# Altium schematic sheet DI_DO.SchDoc
size A2; SheetNumber: 4; SheetTotal: 4
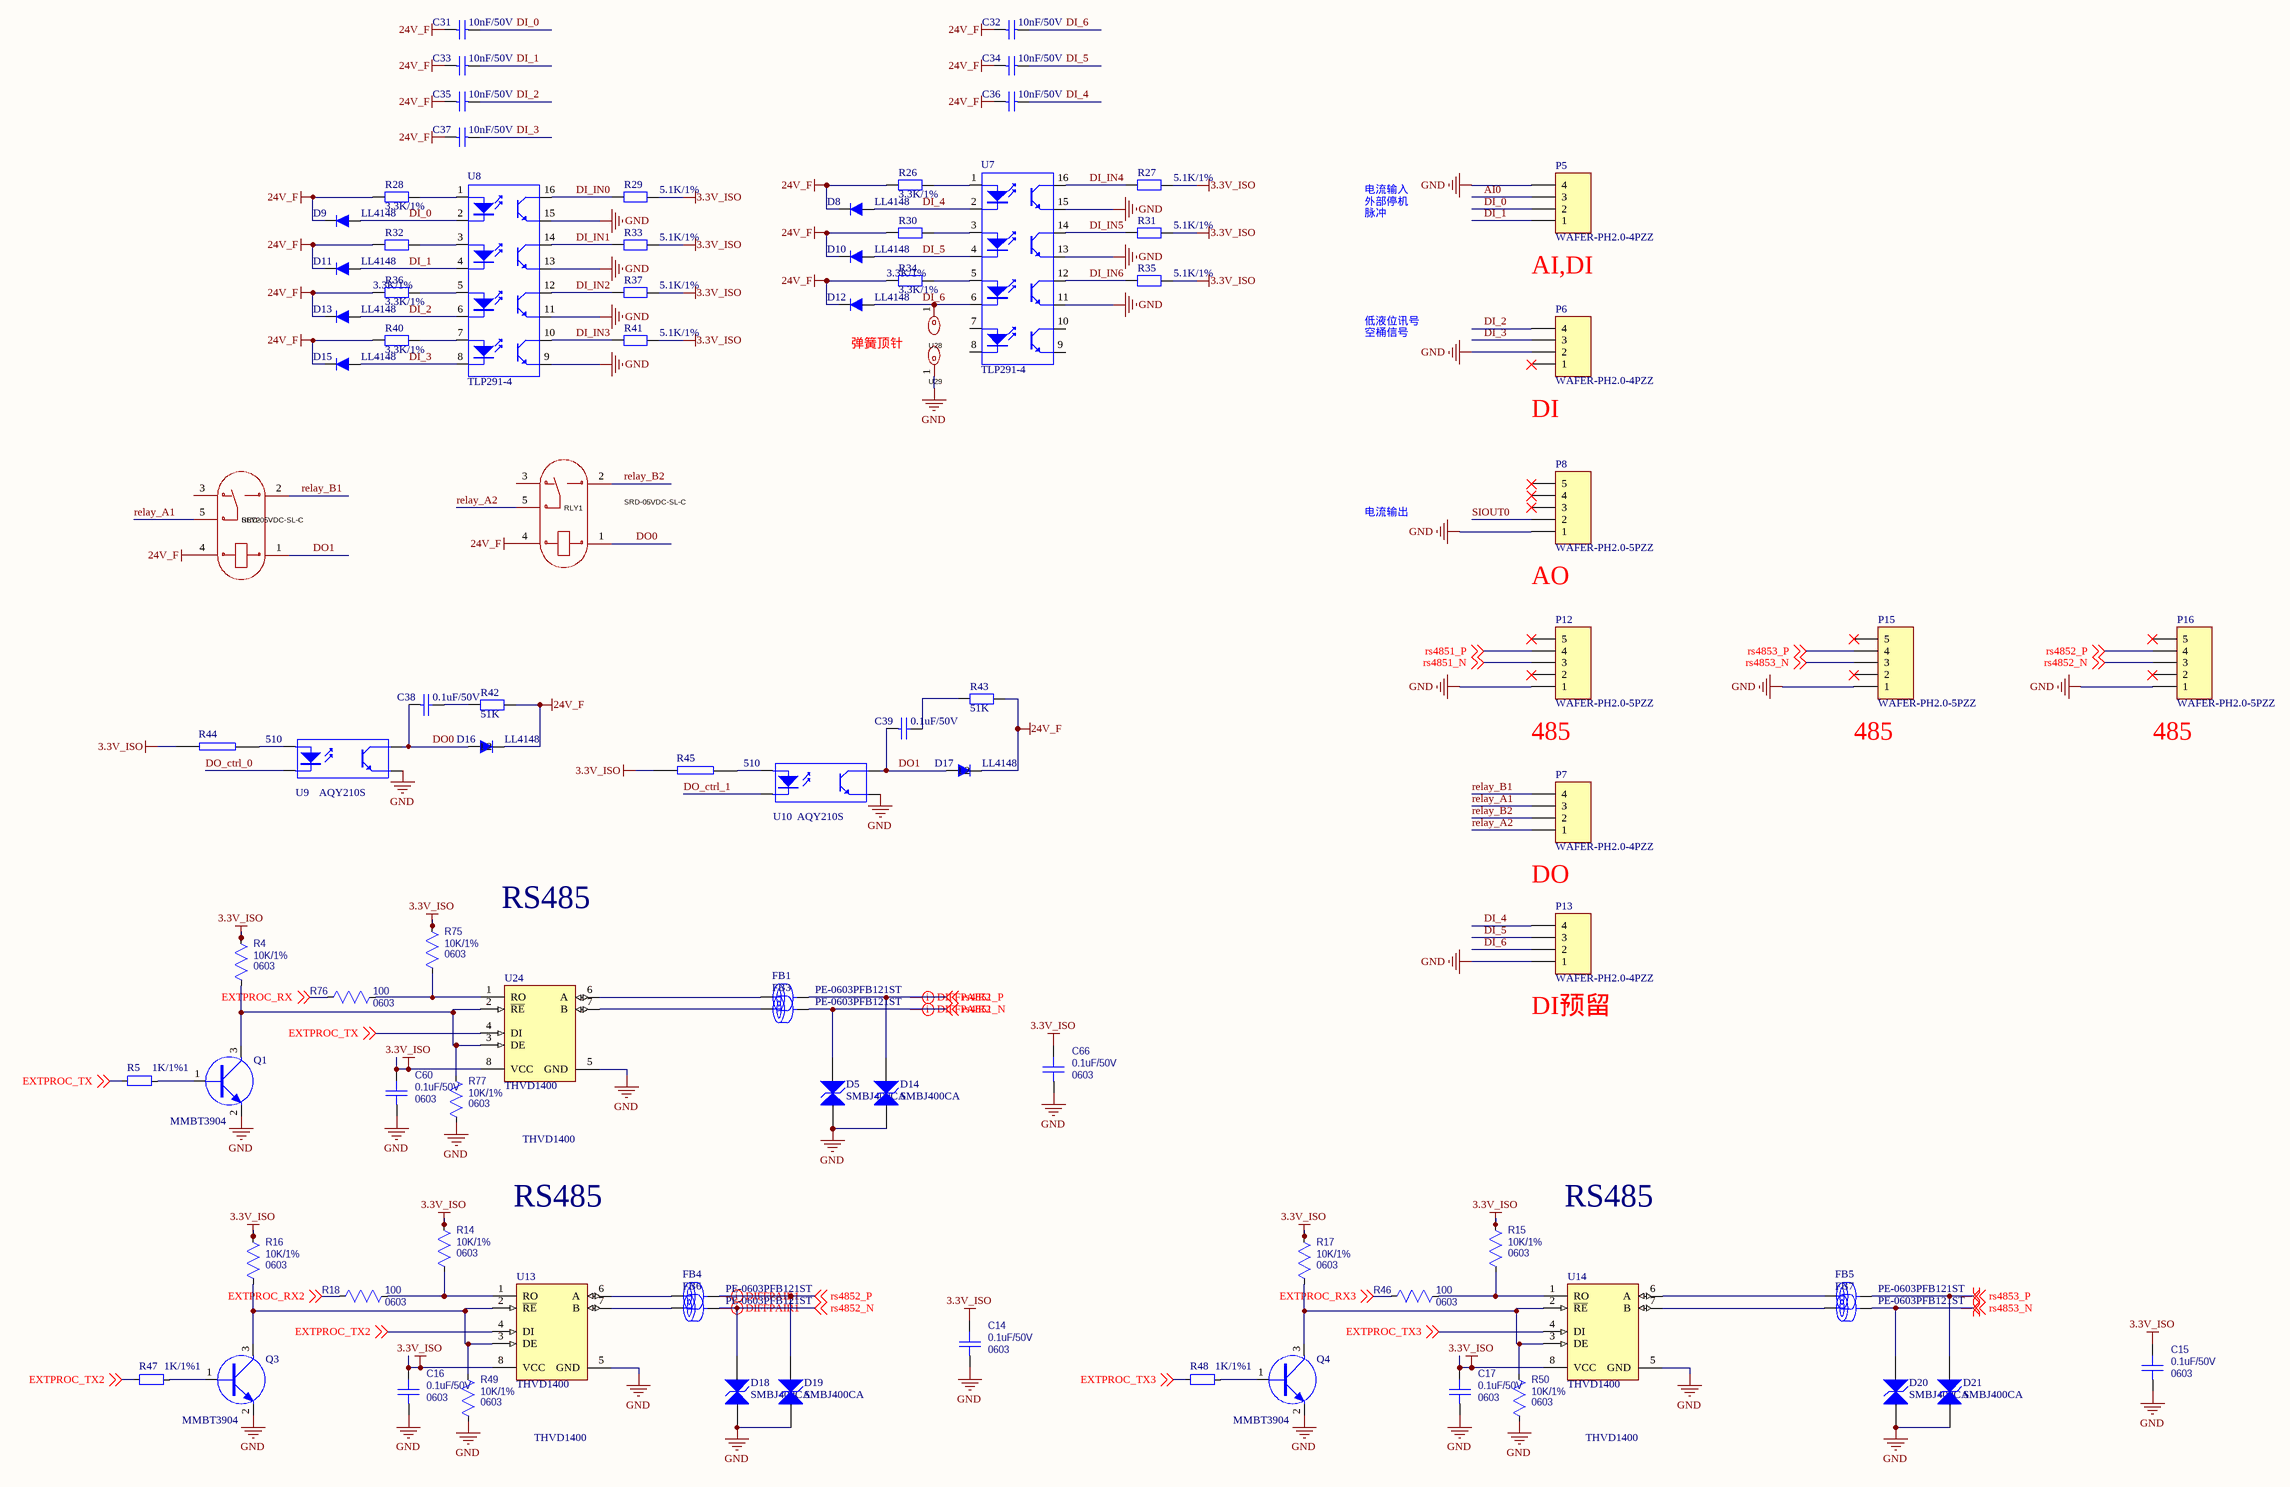
[diagram p0: DI_DO.SchDoc]

## Parts
C14  Package: 0603  [0603C]  (hidden comment: 0.1uF/50V)
C15  Package: 0603  [0603C]  (hidden comment: 0.1uF/50V)
C16  Package: 0603  [0603C]  (hidden comment: 0.1uF/50V)
C17  Package: 0603  [0603C]  (hidden comment: 0.1uF/50V)
C31  10nF/50V  [0603C]
C32  10nF/50V  [0603C]
C33  10nF/50V  [0603C]
C34  10nF/50V  [0603C]
C35  10nF/50V  [0603C]
C36  10nF/50V  [0603C]
C37  10nF/50V  [0603C]
C38  0.1uF/50V  [0603C]
C39  0.1uF/50V  [0603C]
C60  Package: 0603  [0603C]  (hidden comment: 0.1uF/50V)
C66  Package: 0603  [0603C]  (hidden comment: 0.1uF/50V)
D5  SMBJ400CA  [SMB]
D8  LL4148  [DO-213AB/LL34/MiniMELF]
D9  LL4148  [DO-213AB/LL34/MiniMELF]
D10  LL4148  [DO-213AB/LL34/MiniMELF]
D11  LL4148  [DO-213AB/LL34/MiniMELF]
D12  LL4148  [DO-213AB/LL34/MiniMELF]
D13  LL4148  [DO-213AB/LL34/MiniMELF]
D14  SMBJ400CA  [SMB]
D15  LL4148  [DO-213AB/LL34/MiniMELF]
D16  LL4148  [DO-213AB/LL34/MiniMELF]
D17  LL4148  [DO-213AB/LL34/MiniMELF]
D18  SMBJ400CA  [SMB]
D19  SMBJ400CA  [SMB]
D20  SMBJ400CA  [SMB]
D21  SMBJ400CA  [SMB]
FB1  PE-0603PFB121ST  [FBC0603]
FB3  PE-0603PFB121ST  [FBC0603]
FB4  PE-0603PFB121ST  [FBC0603]
FB5  PE-0603PFB121ST  [FBC0603]
FB6  PE-0603PFB121ST  [FBC0603]
FB7  PE-0603PFB121ST  [FBC0603]
P5  WAFER-PH2.0-4PZZ  [CONN#PH2.0-4A]
P6  WAFER-PH2.0-4PZZ  [CONN#PH2.0-4A]
P7  WAFER-PH2.0-4PZZ  [CONN#PH2.0-4A]
P8  WAFER-PH2.0-5PZZ  [CONN#PH2.0-5A]
P12  WAFER-PH2.0-5PZZ  [CONN#PH2.0-5A]
P13  WAFER-PH2.0-4PZZ  [CONN#PH2.0-4A]
P15  WAFER-PH2.0-5PZZ  [CONN#PH2.0-5A]
P16  WAFER-PH2.0-5PZZ  [CONN#PH2.0-5A]
Q1  MMBT3904  [SOT23-3]
Q3  MMBT3904  [SOT23-3]
Q4  MMBT3904  [SOT23-3]
R4  Package: 0603  [0603R]  (hidden comment: 10K/1%)
R5  1K/1%1  [0603r]
R14  Package: 0603  [0603R]  (hidden comment: 10K/1%)
R15  Package: 0603  [0603R]  (hidden comment: 10K/1%)
R16  Package: 0603  [0603R]  (hidden comment: 10K/1%)
R17  Package: 0603  [0603R]  (hidden comment: 10K/1%)
R18  Package: 0603  [0603R]  (hidden comment: 100)
R26  3.3K/1%  [0603R]
R27  5.1K/1%  [0603R]
R28  3.3K/1%  [0603R]
R29  5.1K/1%  [0603R]
R30  3.3K/1%  [0603R]
R31  5.1K/1%  [0603R]
R32  3.3K/1%  [0603R]
R33  5.1K/1%  [0603R]
R34  3.3K/1%  [0603R]
R35  5.1K/1%  [0603R]
R36  3.3K/1%  [0603R]
R37  5.1K/1%  [0603R]
R40  3.3K/1%  [0603R]
R41  5.1K/1%  [0603R]
R42  51K  [0603R]
R43  51K  [0603R]
R44  510  [0603R]
R45  510  [0603R]
R46  Package: 0603  [0603R]  (hidden comment: 100)
R47  1K/1%1  [0603r]
R48  1K/1%1  [0603r]
R49  Package: 0603  [0603R]  (hidden comment: 10K/1%)
R50  Package: 0603  [0603R]  (hidden comment: 10K/1%)
R75  Package: 0603  [0603R]  (hidden comment: 10K/1%)
R76  Package: 0603  [0603R]  (hidden comment: 100)
R77  Package: 0603  [0603R]  (hidden comment: 10K/1%)
RLY1  SRD-05VDC-SL-C  [RELAY-TH_SRD-XXVDC-XL-C]
RLY2  SRD-05VDC-SL-C  [RELAY-TH_SRD-XXVDC-XL-C]
U7  TLP291-4  [SOP16-T]
U8  TLP291-4  [SOP16-T]
U9  AQY210S  [sop4]
U10  AQY210S  [sop4]
U13  THVD1400  [MAXM-S8+4_M]
U14  THVD1400  [MAXM-S8+4_M]
U24  THVD1400  [MAXM-S8+4_M]
U28  YTC1P-3015-01  [CONN-SMD_YTC1P-3015-01]  (value not drawn)
U29  YTC1P-3015-01  [CONN-SMD_YTC1P-3015-01]  (value not drawn)

## Nets
3.3V_ISO: C14.1 C15.1 C16.1 C17.1 C60.1 C66.1 R4.2 R14.2 R15.2 R16.2 R17.2 R27.1 R29.1 R31.1 R33.1 R35.1 R37.1 R41.1 R44.2 R45.2 R75.2 U13.8(VCC) U14.8(VCC) U24.8(VCC)
24V_F: C31.1 C32.1 C33.1 C34.1 C35.1 C36.1 C37.1 D8.2 D9.2 D10.2 D11.2 D12.2 D13.2 D15.2 D16.2(1) D17.2(1) R26.2 R28.2 R30.2 R32.2 R34.2 R36.2 R40.2 R42.2 R43.2 RLY1.4 RLY2.4
GND: C14.2 C15.2 C16.2 C17.2 C60.2 C66.2 D5.1(A) D14.1(A) D18.1(A) D19.1(A) D20.1(A) D21.1(A) P5.4 P6.2 P8.1 P12.1 P13.1 P15.1 P16.1 Q1.2(E) Q3.2(E) Q4.2(E) R49.1 R50.1 R77.1 U7.11(E) U7.13(E) U7.15(E) U8.9(E) U8.11(E) U8.13(E) U8.15(E) U9.3(E) U10.3(E) U13.5(GND) U14.5(GND) U24.5(GND) U29.1
AI0: P5.3
DI_0: C31.2 D9.1 P5.2 U8.2(K)
DI_1: C33.2 D11.1 P5.1 U8.4(K)
DI_2: C35.2 D13.1 P6.4 U8.6(K)
DI_3: C37.2 D15.1 P6.3 U8.8(K)
DI_4: C36.2 D8.1 P13.4 U7.2(K)
DI_5: C34.2 D10.1 P13.3 U7.4(K)
DI_6: C32.2 D12.1 P13.2 U7.6(K) U28.1
DI_IN0: R29.2 U8.16(C)
DI_IN1: R33.2 U8.14(C)
DI_IN2: R37.2 U8.12(C)
DI_IN3: R41.2 U8.10(C)
DI_IN4: R27.2 U7.16(C)
DI_IN5: R31.2 U7.14(C)
DI_IN6: R35.2 U7.12(C)
DO0: C38.1 D16.1(2) RLY1.1 U9.4(C)
DO1: C39.1 D17.1(2) RLY2.1 U10.4(C)
DO_ctrl_0: U9.2(K)
DO_ctrl_1: U10.2(K)
EXTPROC_RX: R76.2 ; off-sheet EXTPROC_RX
EXTPROC_RX2: R18.2 ; off-sheet EXTPROC_RX2
EXTPROC_RX3: R46.2 ; off-sheet EXTPROC_RX3
EXTPROC_TX: R5.1 U24.4(DI) ; off-sheet EXTPROC_TX
EXTPROC_TX2: R47.1 U13.4(DI) ; off-sheet EXTPROC_TX2
EXTPROC_TX3: R48.1 U14.4(DI) ; off-sheet EXTPROC_TX3
relay_A1: P7.3 RLY2.5
relay_A2: P7.1 RLY1.5
relay_B1: P7.4 RLY2.2
relay_B2: P7.2 RLY1.2
rs4851_N: D5.2(A) FB3.2 P12.3 ; off-sheet rs4851_N
rs4851_P: D14.2(A) FB1.2 P12.4 ; off-sheet rs4851_P
rs4852_N: D18.2(A) FB6.2 P16.3 ; off-sheet rs4852_N
rs4852_P: D19.2(A) FB4.2 P16.4 ; off-sheet rs4852_P
rs4853_N: D20.2(A) FB7.2 P15.3 ; off-sheet rs4853_N
rs4853_P: D21.2(A) FB5.2 P15.4 ; off-sheet rs4853_P
SIOUT0: P8.2
NetC38_2: C38.2 R42.1
NetC39_2: C39.2 R43.1
NetFB1_1: FB1.1 U24.6(A)
NetFB3_1: FB3.1 U24.7(B)
NetFB4_1: FB4.1 U13.6(A)
NetFB5_1: FB5.1 U14.6(A)
NetFB6_1: FB6.1 U13.7(B)
NetFB7_1: FB7.1 U14.7(B)
NetQ1_1: Q1.1(B) R5.2
NetQ1_3: Q1.3(C) R4.1 R77.2 U24.2(~{RE}) U24.3(DE)
NetQ3_1: Q3.1(B) R47.2
NetQ3_3: Q3.3(C) R16.1 R49.2 U13.2(~{RE}) U13.3(DE)
NetQ4_1: Q4.1(B) R48.2
NetQ4_3: Q4.3(C) R17.1 R50.2 U14.2(~{RE}) U14.3(DE)
NetR14_1: R14.1 R18.1 U13.1(RO)
NetR15_1: R15.1 R46.1 U14.1(RO)
NetR26_1: R26.1 U7.1(A)
NetR28_1: R28.1 U8.1(A)
NetR30_1: R30.1 U7.3(A)
NetR32_1: R32.1 U8.3(A)
NetR34_1: R34.1 U7.5(A)
NetR36_1: R36.1 U8.5(A)
NetR40_1: R40.1 U8.7(A)
NetR44_1: R44.1 U9.1(A)
NetR45_1: R45.1 U10.1(A)
NetR75_1: R75.1 R76.1 U24.1(RO)

Not connected (* = marked no-connect by the designer): P6 1*; P8 3* 4* 5*; P12 2* 5*; P15 2* 5*; P16 2* 5*; RLY1 3; RLY2 3; U7 7(A) 8(K) 9(E) 10(C)

## Layout directives
differential pair: rs4851_N, rs4851_P, rs4852_N, rs4852_P, rs4853_N, rs4853_P

## Notes on the sheet
- 电流输入
- 外部停机
- 脉冲
- AI,DI
- (near D12) 弹簧顶针
- 低液位讯号
- 空桶信号
- (near P6) DI
- 电流输出
- AO
- 485
- (near P15) 485
- (near P16) 485
- DO
- RS485
- (near P13) DI预留
- THVD1400

## Library data of the parts
C14-C17 C60 C66 = Capacitor_0603: Capacitor, MLCC; Voltage Rating: [voltage]; Value: 0.1uF/50V
C31-C37 = Cap: Capacitor; Value: 10nF/50V; Package: 0603
C38 C39 = CAP: Capacitor; Package: 0603; Value: 0.1uF/50V
D5 D14 D18-D21 = SMAJ12CA: Transient Voltage Suppression Diode, 400 W, 33 V, -65 to 150 degC, 2-Pin SMD, RoHS, Tape and Reel; Value: SMBJ400CA; Package: SMB
D8-D13 D15-D17 = LL4148: VISHAY,LL4148,圆柱体MiniMELF100V/2A,ROHS; 版本: V1.00; 名称: 快速开关二极管; 物料编号: APLLY; 制造商: VISHAY; Package: DO-213AB/LL34/MiniMELF
FB1 FB3-FB7 = FBC0603: Ferrite Bead Chip; Value: PE-0603PFB121ST; Package: FBC0603
P5-P7 P13 = Header 4: Header, 4-Pin; Package: CONN#PH2.0-4A
P8 P12 P15 P16 = Header 5: Header, 5-Pin; Package: CONN#PH2.0-5A
Q1 Q3 Q4 = NPN_MMBT3904: Package: SOT23-3
R4 R14-R18 R46 R49 R50 R75-R77 = Resistor_0603: Resistor, Standard
  R4 R14-R17 R49 R50 R75 R77: Value: 10K/1%
  R18 R46 R76: Value: 100
R5 R47 R48 = RES0603: 物料主编码(PN): 150000040; Value: 1K; 序号: 109; 物料名称: 贴片电阻; 精度: ±1%; 规格型号(完整型号): RC1608F103CS/RC0603FR-0710KL; 物料描述: RES,贴片电阻,0603,10k,±1%,1/10W,1.6X0.8X0.45mm,RC1608F103CS/RC0603FR-0710KL; 工作温度: –55°C to 155°C; 制造商: 三星/YAGEO; 器件等级: ——; 物料类型: 表贴电阻; 参数值: 1.00E+04; Package: 0603
R26-R37 R40-R43 = Res0805M: Package: 0603
R44 R45 = RES2: Package: 0603
U7 U8 = TLP281-4: Package: SOP16-T
U9 U10 = Optoisolator1: 4-Pin Phototransistor Optocoupler; Package: sop4
U13 U14 U24 = MAX33071EASA+: RS-485 Half-Duplex Transceiver with ±65V Fault Protection,+3V to +5.5V, -40 to 125 degC, 8-Pin SOIC (S8+4), RoHS, Tube; VOUT: 3.000 V; VIN: 3.2 to 12.6 V; Value: MAX33071EASA+; Package: MAXM-S8+4_M
RLY1 RLY2 = SRD-05VDC-SL-C: Package: RELAY-TH_SRD-XXVDC-XL-C
U28 U29 = YTC1P-3015-01: Package: CONN-SMD_YTC1P-3015-01